# EAGLE design audio_board (EAGLE 8.2.2)
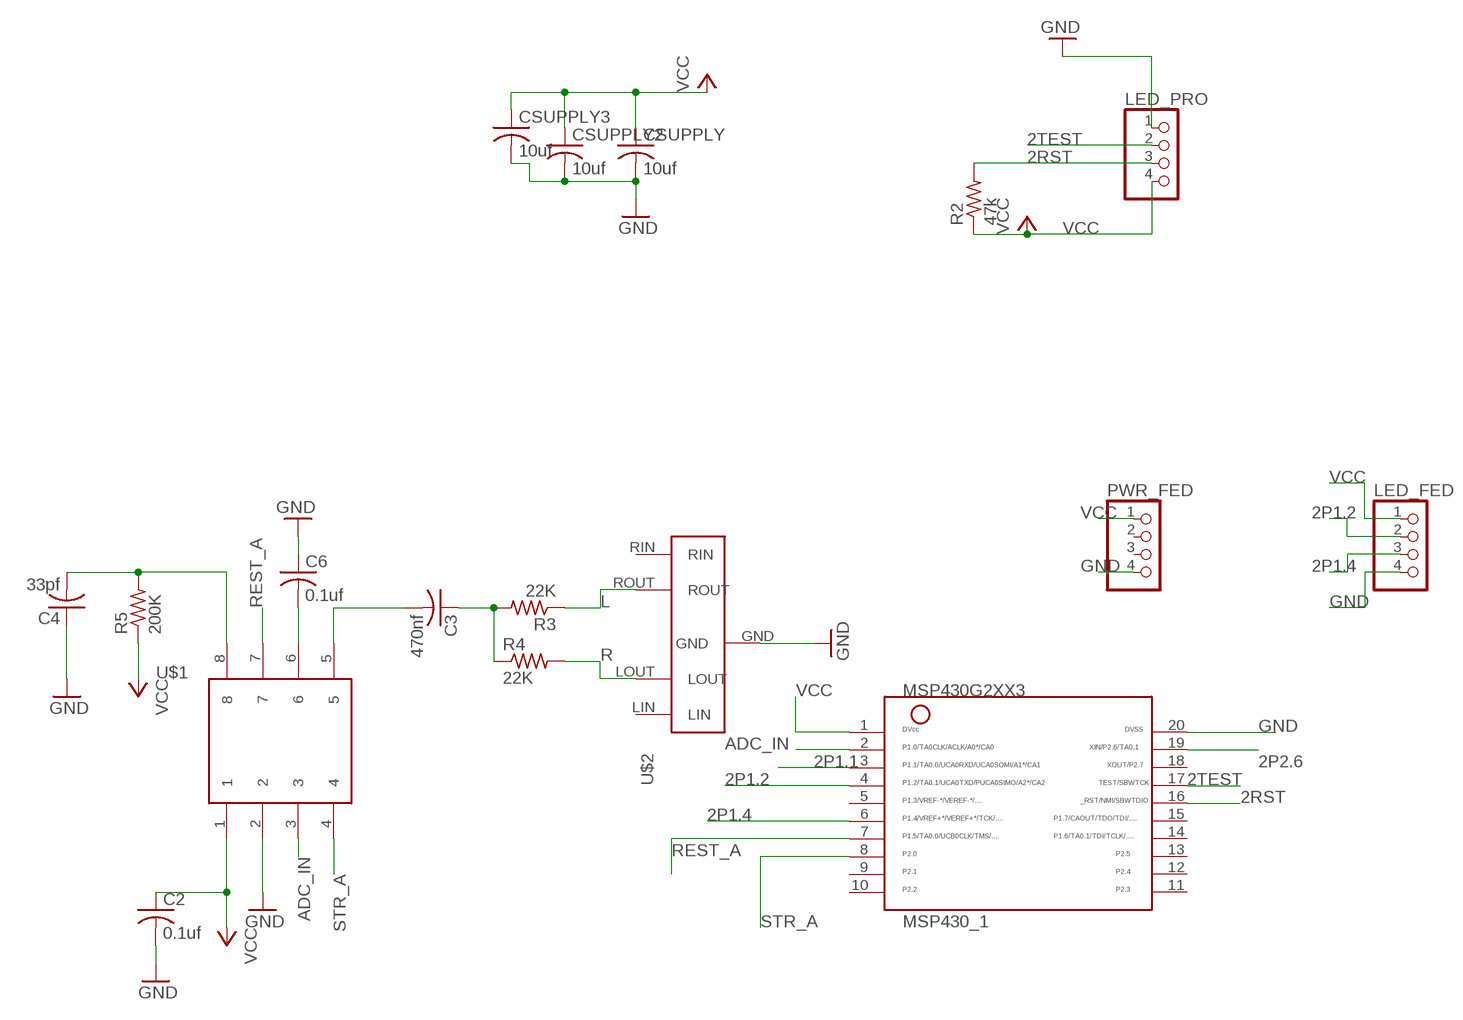
[diagram p0: schematic, sheet 1]

## Parts
C2  0.1uf  C-USC1206  [C1206]
C3  470nf  C-USC1206  [C1206]
C4  33pf  C-USC1206  [C1206]
C6  0.1uf  C-USC1206  [C1206]
CSUPPLY  10uf  C-USC1206  [C1206]
CSUPPLY2  10uf  C-USC1206  [C1206]
CSUPPLY3  10uf  C-USC1206  [C1206]
LED_FED  PINHD-1X4  [1X04]
LED_PRO  PINHD-1X4  [1X04]
MSP430_1  MSP430G2XX3TSSOP  [PW20]
PWR_FED  PINHD-1X4  [1X04]
R2  47k  R-US_R1206  [R1206]
R3  22K  R-US_R1206  [R1206]
R4  22K  R-US_R1206  [R1206]
R5  200K  R-US_R1206  [R1206]
U$1  MSGEQ7  [MSGEQ7]
U$2  1699_HEAD  [1699_HEAD]

## Nets
2P1.1: MSP430_1.3
2P1.2: LED_FED.2 MSP430_1.4
2P1.4: LED_FED.3 MSP430_1.6
2P2.6: MSP430_1.19
2RST: LED_PRO.3 MSP430_1.16 R2.2
2TEST: LED_PRO.2 MSP430_1.17
ADC_IN: MSP430_1.2 U$1.3
GND: C2.2 C4.1 C6.1 CSUPPLY2.2 CSUPPLY3.2 CSUPPLY.2 LED_FED.4 LED_PRO.1 MSP430_1.20 PWR_FED.4 U$1.2 U$2.GND
L: R3.1 U$2.ROUT
N$1: C3.2 U$1.5
N$2: C3.1 R3.2 R4.1
N$3: C6.2 U$1.6
N$4: C4.2 R5.2 U$1.8
R: R4.2 U$2.LOUT
REST_A: MSP430_1.7 U$1.7
STR_A: MSP430_1.8 U$1.4
VCC: C2.1 CSUPPLY2.1 CSUPPLY3.1 CSUPPLY.1 LED_FED.1 LED_PRO.4 MSP430_1.1 PWR_FED.1 R2.1 R5.1 U$1.1
Unconnected: MSP430_1.5 MSP430_1.9 MSP430_1.10 MSP430_1.11 MSP430_1.12 MSP430_1.13 MSP430_1.14 MSP430_1.15 MSP430_1.18 PWR_FED.2 PWR_FED.3 U$2.LIN U$2.RIN

## Library data of the parts
C2-C4 C6 CSUPPLY CSUPPLY2 CSUPPLY3 = rcl:C-US: CAPACITOR, American symbol
LED_FED LED_PRO PWR_FED = pinhead:PINHD-1X4: PIN HEADER
MSP430_1 = ELEC327:MSP430G2XX3: MSP430G2XX3 PDIP (N) 20 Pin Package
R2-R5 = resistor:R-US_: RESISTOR, American symbol
U$1 = msgeq7:MSGEQ7
U$2 = 1699_Head:1699_HEAD

## Board
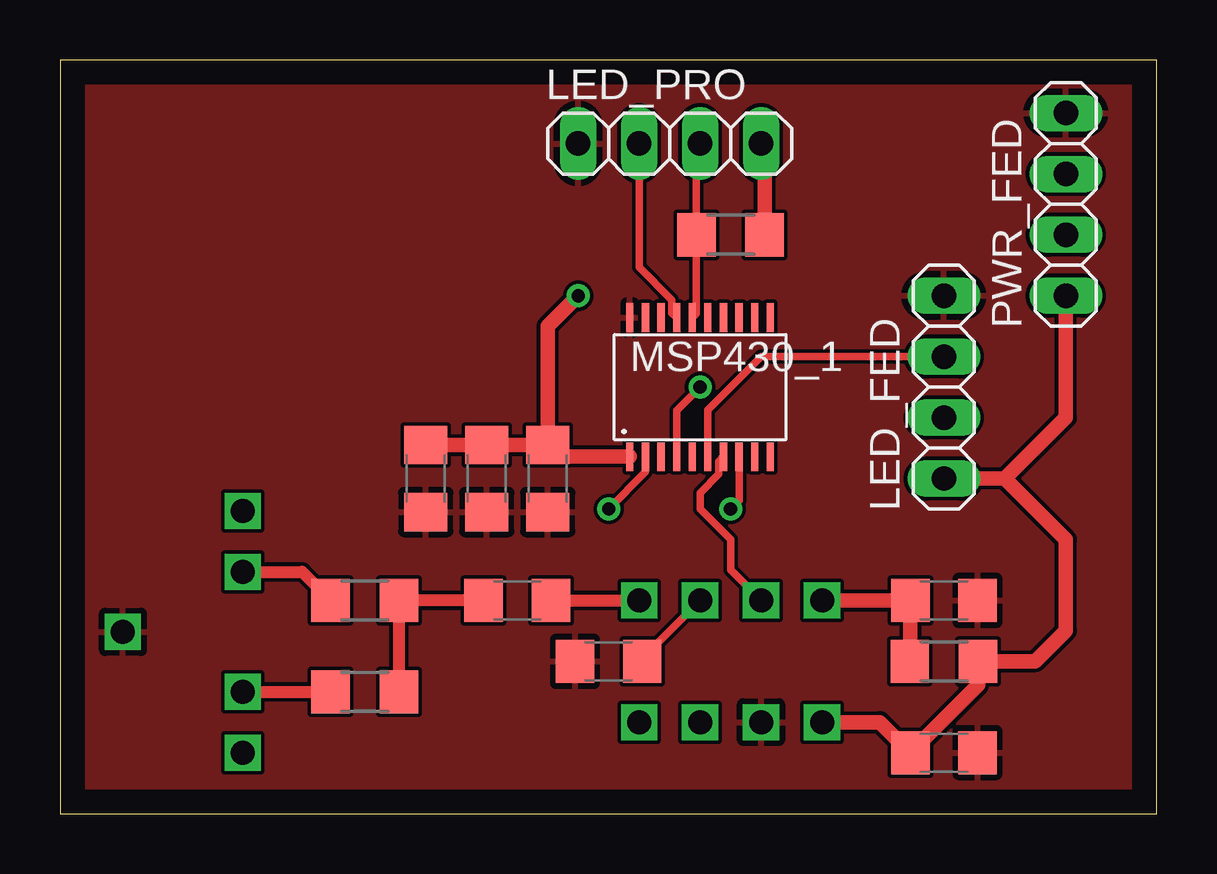
[diagram p1: board, top side]
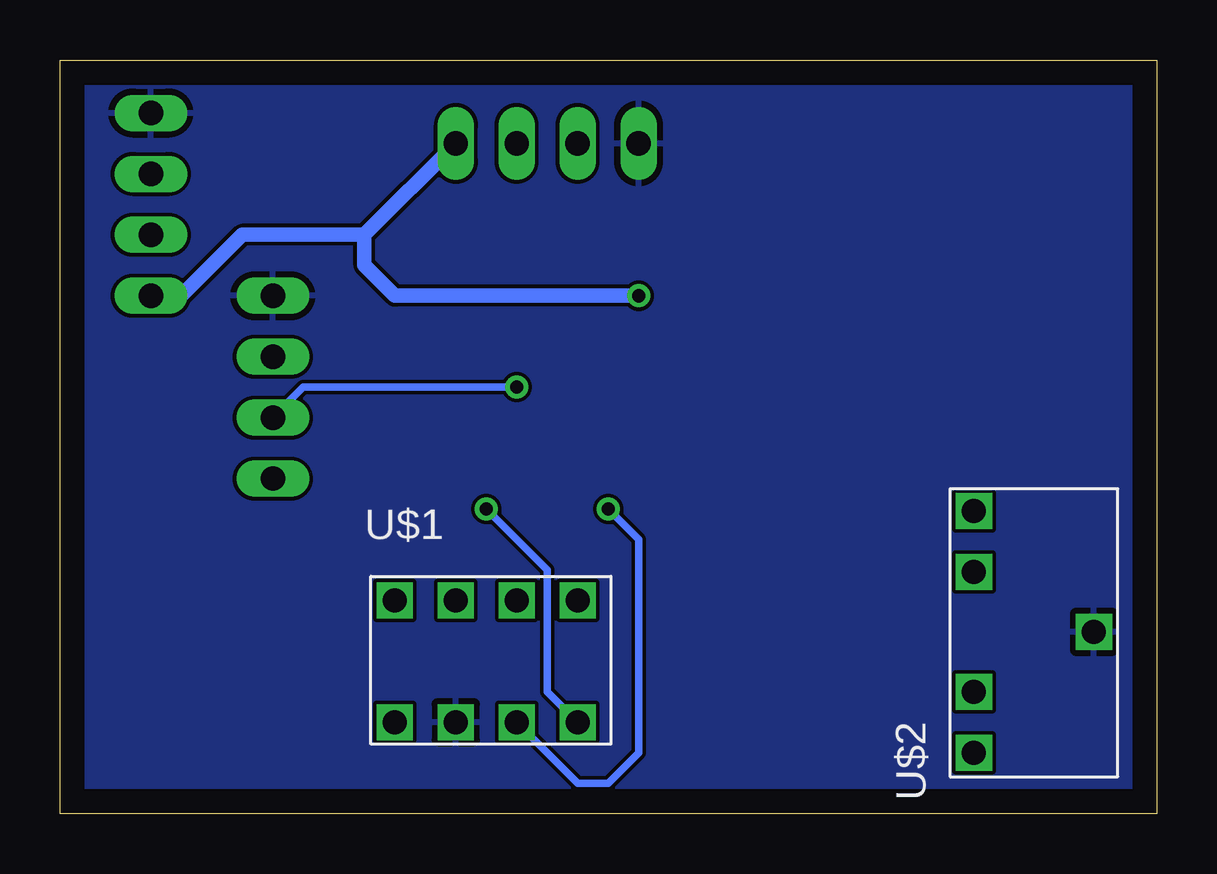
[diagram p2: board, bottom side, seen from below]

Size 45.7 x 31.42 mm. Coordinates in mm from the lower left corner, seen from the top.
Outline: 0,0 45.7,0 45.7,31.42 0,31.42 0,0
Copper layers (1*16): Top 0.035mm / dielectric 1.5mm / Bottom 0.035mm
Design rules "default": minimum track width 6mil, minimum drill 0.35mm, track to track 6mil, track to pad 6mil, pad to pad 6mil, via to via 6mil, smd to smd 6mil, copper to edge 40mil, drill to drill 6mil, minimum pad ring 10mil, minimum via ring 8mil, stop-mask expansion 4mil, vias tented up to drill 0mil, thermal gap 10mil

### Footprints (pad centres in the part's own frame; a part is rotated, then mirrored left to right if it is on the bottom)
C1206 = smd 1.6 x 1.8: 1 -1.4,0; 2 1.4,0
1X04 = drill 1.016 long: 1 -3.81,0; 2 -1.27,0; 3 1.27,0; 4 3.81,0
PW20 = smd 0.3 x 1.2: 1 -2.925,-2.9; 2 -2.275,-2.9; 3 -1.625,-2.9; 4 -0.975,-2.9; 5 -0.325,-2.9; 6 0.325,-2.9; 7 0.975,-2.9; 8 1.625,-2.9; 9 2.275,-2.9; 10 2.925,-2.9; 11 2.925,2.9; 12 2.275,2.9; 13 1.625,2.9; 14 0.975,2.9; 15 0.325,2.9; 16 -0.325,2.9; 17 -0.975,2.9; 18 -1.625,2.9; 19 -2.275,2.9; 20 -2.925,2.9
R1206 = smd 1.6 x 1.803: 1 -1.422,0; 2 1.422,0
MSGEQ7 = drill 1 square: 1 0,-5.08; 2 2.54,-5.08; 3 5.08,-5.08; 4 7.62,-5.08; 5 7.62,0; 6 5.08,0; 7 2.54,0; 8 0,0
1699_HEAD = drill 1 square: GND 5.04,-5; LIN 0,0; LOUT 2.54,0; RIN 10.08,0; ROUT 7.54,0

### Placement (x,y rotation side)
C2  36.83,2.54 0 top
C3  19.05,8.89 0 top
C4  36.83,8.89 180 top
C6  22.86,6.35 0 top
CSUPPLY  17.78,13.97 270 top
CSUPPLY2  15.24,13.97 270 top
CSUPPLY3  20.32,13.97 270 top
LED_FED  36.83,17.78 90 top
LED_PRO  25.4,27.94 0 top
MSP430_1  26.67,17.78 0 top
PWR_FED  41.91,25.4 90 top
R2  27.94,24.13 180 top
R3  12.7,8.89 0 top
R4  12.7,5.08 180 top
R5  36.83,6.35 180 top
U$1  31.75,8.89 0 bottom
U$2  7.62,2.54 90 bottom

### Tracks (layer width: path | path; a pad name or v marks a point on that pad's centre or on a via)
2P1.2  (via drill 0.55)
  Top 0.305: MSP430_1.4 25.7,16.8 v26.67,17.78
  Bottom 0.305: v26.67,17.78 35.56,17.78 LED_FED.2
2P1.4
  Top 0.305: MSP430_1.6 27,16.84 29.21,19.05 LED_FED.3
2RST
  Top 0.305: MSP430_1.16 26.52,20.85 R2.2 26.52,27.79 LED_PRO.3
2TEST
  Top 0.305: MSP430_1.17 25.5,20.88 25.5,21.41 24.13,22.78 LED_PRO.2
ADC_IN  (via drill 0.55)
  Top 0.305: MSP430_1.2 24.39,14.23 v22.86,12.7
  Bottom 0.305: v22.86,12.7 21.59,11.43 21.59,2.54 22.86,1.27 24.13,1.27 U$1.3
GND
  pour Top: 0,0 0,31.75 45.72,31.75 45.72,0
  pour Bottom: 0,31.75 45.72,31.75 45.72,0 0,0
L
  Top 0.508: U$2.ROUT 10.09,10.08 R3.1
N$1
  Top 0.508: C3.2 U$1.5
N$2
  Top 0.508: C3.1 R3.2 R4.1
N$3
  Top 0.305: C6.2 24.26,6.48 U$1.6
N$4
  Top 0.61: U$1.8 C4.2 35.43,6.37 R5.2
R
  Top 0.508: U$2.LOUT R4.2
REST_A
  Top 0.305: U$1.7 27.94,10.16 27.94,11.43 26.67,12.7 26.67,13.37 27.45,14.15 27.45,14.69 MSP430_1.7
STR_A  (via drill 0.55)
  Top 0.305: MSP430_1.8 28.29,13.05 v27.94,12.7
  Bottom 0.305: U$1.4 25.4,5.08 25.4,10.16 v27.94,12.7
VCC  (via drill 0.55)
  Top 0.61: MSP430_1.1 20.81,14.88 CSUPPLY3.1 | CSUPPLY3.1 CSUPPLY.1 CSUPPLY2.1 | U$1.1 34.16,3.81 C2.1 38.25,5.36 R5.1 40.64,6.35 41.91,7.62 41.91,11.43 39.37,13.97 | R2.1 29.36,27.79 LED_PRO.4 | CSUPPLY3.1 20.32,20.32 v21.59,21.59 | 39.37,13.97 LED_FED.1 | 39.37,13.97 41.91,16.51 PWR_FED.1
  Bottom 0.61: v21.59,21.59 31.75,21.59 33.02,22.86 33.02,24.13 | 33.02,24.13 LED_PRO.4 | 33.02,24.13 38.1,24.13 40.64,21.59 PWR_FED.1